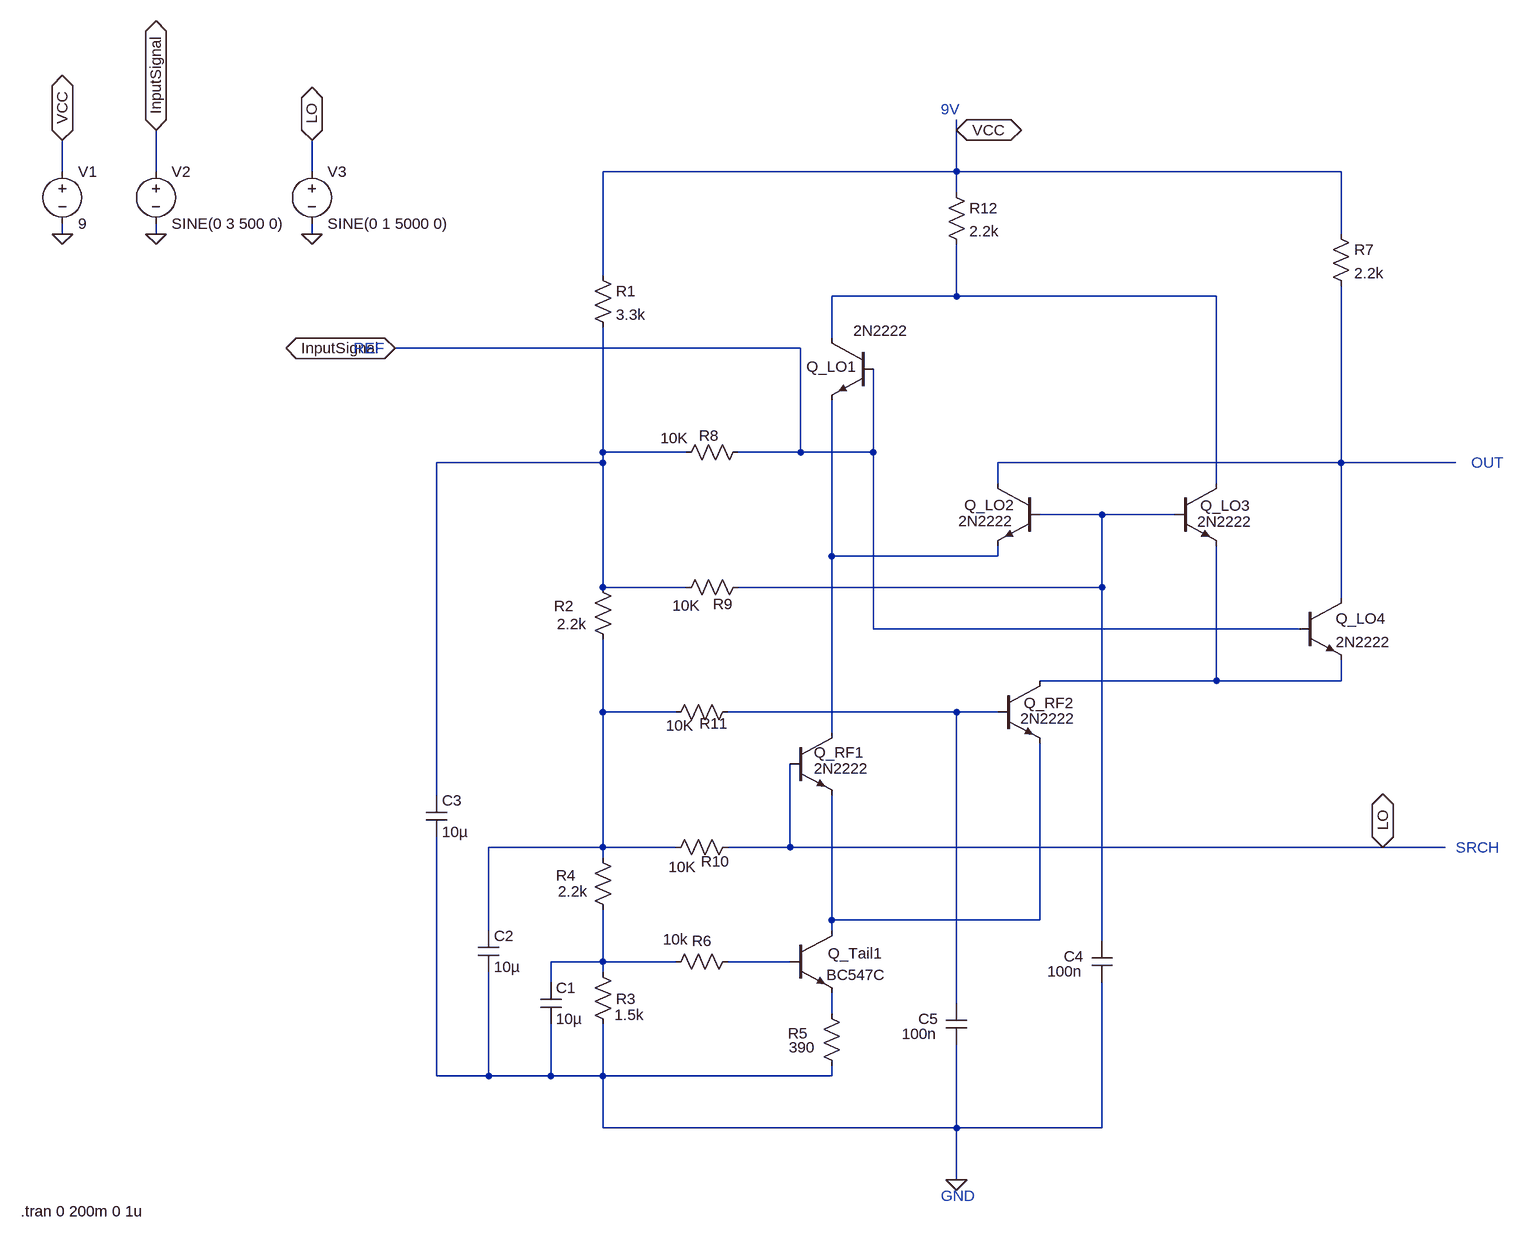
[diagram p0: schematic Gilbert Cell.asc]
Gilbert Cell.asc, the LTspice schematic file:
Version 4.1
SHEET 1 1116 832
WIRE 272 -848 272 -864
WIRE -1104 -784 -1104 -832
WIRE -960 -784 -960 -848
WIRE -720 -784 -720 -832
WIRE 272 -784 272 -848
WIRE 272 -784 -272 -784
WIRE 864 -784 272 -784
WIRE 272 -752 272 -784
WIRE -1104 -688 -1104 -704
WIRE -960 -688 -960 -704
WIRE -720 -688 -720 -704
WIRE 864 -688 864 -784
WIRE -272 -624 -272 -784
WIRE 272 -592 272 -672
WIRE 272 -592 80 -592
WIRE 672 -592 272 -592
WIRE 80 -528 80 -592
WIRE 32 -512 -592 -512
WIRE -272 -352 -272 -544
WIRE -144 -352 -272 -352
WIRE 32 -352 32 -512
WIRE 32 -352 -64 -352
WIRE 144 -352 144 -480
WIRE 144 -352 32 -352
WIRE -272 -336 -272 -352
WIRE -272 -336 -528 -336
WIRE 864 -336 864 -608
WIRE 864 -336 336 -336
WIRE 1040 -336 864 -336
WIRE 336 -304 336 -336
WIRE 672 -304 672 -592
WIRE 496 -256 400 -256
WIRE 608 -256 496 -256
WIRE 80 -192 80 -432
WIRE 336 -192 336 -208
WIRE 336 -192 80 -192
WIRE -272 -144 -272 -336
WIRE -144 -144 -272 -144
WIRE 496 -144 496 -256
WIRE 496 -144 -64 -144
WIRE 864 -128 864 -336
WIRE 144 -80 144 -352
WIRE 800 -80 144 -80
WIRE 672 0 672 -208
WIRE 672 0 400 0
WIRE 864 0 864 -32
WIRE 864 0 672 0
WIRE -272 48 -272 -64
WIRE -160 48 -272 48
WIRE 272 48 -80 48
WIRE 336 48 272 48
WIRE 80 80 80 -192
WIRE -528 176 -528 -336
WIRE -272 256 -272 48
WIRE -272 256 -448 256
WIRE -160 256 -272 256
WIRE 16 256 16 128
WIRE 16 256 -80 256
WIRE 928 256 16 256
WIRE 1024 256 928 256
WIRE -272 272 -272 256
WIRE 80 368 80 176
WIRE 400 368 400 96
WIRE 400 368 80 368
WIRE -448 384 -448 256
WIRE 80 384 80 368
WIRE 496 400 496 -144
WIRE -272 432 -272 352
WIRE -272 432 -352 432
WIRE -160 432 -272 432
WIRE 16 432 -80 432
WIRE -272 448 -272 432
WIRE -352 464 -352 432
WIRE 272 496 272 48
WIRE 80 512 80 480
WIRE -528 608 -528 240
WIRE -448 608 -448 448
WIRE -448 608 -528 608
WIRE -352 608 -352 528
WIRE -352 608 -448 608
WIRE -272 608 -272 528
WIRE -272 608 -352 608
WIRE 80 608 80 592
WIRE 80 608 -272 608
WIRE -272 688 -272 608
WIRE 272 688 272 560
WIRE 272 688 -272 688
WIRE 496 688 496 464
WIRE 496 688 272 688
WIRE 272 768 272 688
FLAG -1104 -688 0
FLAG -960 -688 0
FLAG -720 -688 0
FLAG 272 768 0
FLAG -1104 -832 VCC
IOPIN -1104 -832 BiDir
FLAG 272 -848 VCC
IOPIN 272 -848 BiDir
FLAG -960 -848 InputSignal
IOPIN -960 -848 BiDir
FLAG -592 -512 InputSignal
IOPIN -592 -512 BiDir
FLAG -720 -832 LO
IOPIN -720 -832 BiDir
FLAG 928 256 LO
IOPIN 928 256 BiDir
SYMBOL npn 16 80 R0
WINDOW 0 37 30 Left 2
WINDOW 3 37 55 Left 2
SYMATTR InstName Q_RF1
SYMATTR Value 2N2222
SYMBOL npn 16 384 R0
WINDOW 0 58 35 Left 2
SYMATTR InstName Q_Tail1
SYMATTR Value BC547C
SYMBOL res -288 -640 R0
SYMATTR InstName R1
SYMATTR Value 3.3k
SYMBOL res -288 -160 R0
WINDOW 0 -59 45 Left 2
WINDOW 3 -55 72 Left 2
SYMATTR InstName R2
SYMATTR Value 2.2k
SYMBOL res -288 432 R0
WINDOW 0 36 57 Left 2
WINDOW 3 34 82 Left 2
SYMATTR InstName R3
SYMATTR Value 1.5k
SYMBOL res -288 256 R0
WINDOW 0 -56 43 Left 2
WINDOW 3 -53 68 Left 2
SYMATTR InstName R4
SYMATTR Value 2.2k
SYMBOL cap -368 464 R0
SYMATTR Value 10µ
SYMATTR InstName C1
SYMATTR SpiceLine V=10 Irms=23m Rser=2.4699 Lser=942p mfg="Würth Elektronik" pn="865090240001 WCAP-ASLU 4x5,5" type="Al electrolytic"
SYMBOL cap -464 384 R0
SYMATTR Value 10µ
SYMATTR InstName C2
SYMATTR SpiceLine V=10 Irms=23m Rser=2.4699 Lser=942p mfg="Würth Elektronik" pn="865090240001 WCAP-ASLU 4x5,5" type="Al electrolytic"
SYMBOL cap -544 176 R0
SYMATTR Value 10µ
SYMATTR InstName C3
SYMATTR SpiceLine V=10 Irms=23m Rser=2.4699 Lser=942p mfg="Würth Elektronik" pn="865090240001 WCAP-ASLU 4x5,5" type="Al electrolytic"
SYMBOL res 64 496 R0
WINDOW 0 -51 46 Left 2
WINDOW 3 -50 68 Left 2
SYMATTR InstName R5
SYMATTR Value 390
SYMBOL res -64 416 R90
WINDOW 0 0 56 VBottom 2
WINDOW 3 -34 96 VTop 2
SYMATTR InstName R6
SYMATTR Value 10k
SYMBOL npn 336 0 R0
WINDOW 0 40 34 Left 2
WINDOW 3 34 58 Left 2
SYMATTR InstName Q_RF2
SYMATTR Value 2N2222
SYMBOL npn 144 -528 M0
WINDOW 0 25 44 Left 2
WINDOW 3 -54 -11 Left 2
SYMATTR InstName Q_LO1
SYMATTR Value 2N2222
SYMBOL npn 400 -304 M0
WINDOW 0 38 33 Left 2
WINDOW 3 40 58 Left 2
SYMATTR InstName Q_LO2
SYMATTR Value 2N2222
SYMBOL npn 608 -304 R0
WINDOW 0 39 34 Left 2
WINDOW 3 35 59 Left 2
SYMATTR InstName Q_LO3
SYMATTR Value 2N2222
SYMBOL npn 800 -128 R0
SYMATTR InstName Q_LO4
SYMATTR Value 2N2222
SYMBOL res 848 -704 R0
SYMATTR InstName R7
SYMATTR Value 2.2k
SYMBOL res -48 -368 R90
WINDOW 0 6 61 VBottom 2
WINDOW 3 -21 114 VTop 2
SYMATTR InstName R8
SYMATTR Value 10K
SYMATTR SpiceLine tol=1 pwr=0.1
SYMBOL res -48 -160 R90
WINDOW 0 57 39 VBottom 2
WINDOW 3 28 96 VTop 2
SYMATTR InstName R9
SYMATTR Value 10K
SYMATTR SpiceLine tol=1 pwr=0.1
SYMBOL cap 512 464 R180
WINDOW 0 44 40 Left 2
WINDOW 3 46 17 Left 2
SYMATTR InstName C4
SYMATTR Value 100n
SYMATTR SpiceLine V=10 Irms=0 Rser=0.025 Lser=913p
SYMBOL res -64 240 R90
WINDOW 0 53 35 VBottom 2
WINDOW 3 31 86 VTop 2
SYMATTR InstName R10
SYMATTR Value 10K
SYMATTR SpiceLine tol=1 pwr=0.1
SYMBOL res -64 32 R90
WINDOW 0 49 37 VBottom 2
WINDOW 3 21 90 VTop 2
SYMATTR InstName R11
SYMATTR Value 10K
SYMATTR SpiceLine tol=1 pwr=0.1
SYMBOL cap 288 560 R180
WINDOW 0 44 40 Left 2
WINDOW 3 46 17 Left 2
SYMATTR InstName C5
SYMATTR Value 100n
SYMATTR SpiceLine V=10 Irms=0 Rser=0.025 Lser=913p
SYMBOL res 256 -768 R0
SYMATTR InstName R12
SYMATTR Value 2.2k
SYMBOL voltage -1104 -800 R0
WINDOW 123 0 0 Left 0
WINDOW 39 0 0 Left 0
SYMATTR InstName V1
SYMATTR Value 9
SYMBOL voltage -960 -800 R0
WINDOW 123 0 0 Left 0
WINDOW 39 0 0 Left 0
SYMATTR InstName V2
SYMATTR Value SINE(0 3 500 0)
SYMBOL voltage -720 -800 R0
WINDOW 123 0 0 Left 0
WINDOW 39 0 0 Left 0
SYMATTR InstName V3
SYMATTR Value SINE(0 1 5000 0)
TEXT 248 792 Left 2 ;GND
TEXT 248 -880 Left 2 ;9V
TEXT -656 -512 Left 2 ;REF
TEXT 1040 256 Left 2 ;SRCH
TEXT 1064 -336 Left 2 ;OUT
TEXT -1168 816 Left 2 !.tran 0 200m 0 1u

The netlist it stands for:
* Gilbert Cell.asc
Q_RF1 N005 LO N009 0 2N2222
Q_Tail1 N009 N011 N012 0 BC547C
R1 VCC N002 3.3k
R2 N002 N007 2.2k
R3 N010 0 1.5k
R4 N007 N010 2.2k
C1 N010 0 10µ V=10 Irms=23m Rser=2.4699 Lser=942p mfg="Würth Elektronik" pn="865090240001 WCAP-ASLU 4x5,5" type="Al electrolytic"
C2 N007 0 10µ V=10 Irms=23m Rser=2.4699 Lser=942p mfg="Würth Elektronik" pn="865090240001 WCAP-ASLU 4x5,5" type="Al electrolytic"
C3 N002 0 10µ V=10 Irms=23m Rser=2.4699 Lser=942p mfg="Würth Elektronik" pn="865090240001 WCAP-ASLU 4x5,5" type="Al electrolytic"
R5 N012 0 390
R6 N011 N010 10k
Q_RF2 N006 N008 N009 0 2N2222
Q_LO1 N001 InputSignal N005 0 2N2222
Q_LO2 N003 N004 N005 0 2N2222
Q_LO3 N001 N004 N006 0 2N2222
Q_LO4 N003 InputSignal N006 0 2N2222
R7 VCC N003 2.2k
R8 InputSignal N002 10K tol=1 pwr=0.1
R9 N004 N002 10K tol=1 pwr=0.1
C4 0 N004 100n V=10 Irms=0 Rser=0.025 Lser=913p
R10 LO N007 10K tol=1 pwr=0.1
R11 N008 N007 10K tol=1 pwr=0.1
C5 0 N008 100n V=10 Irms=0 Rser=0.025 Lser=913p
R12 VCC N001 2.2k
V1 VCC 0 9
V2 InputSignal 0 SINE(0 3 500 0)
V3 LO 0 SINE(0 1 5000 0)
.model NPN NPN
.model PNP PNP
.lib standard.bjt
* GND
* 9V
* REF
* SRCH
* OUT
.tran 0 200m 0 1u
.backanno
.end